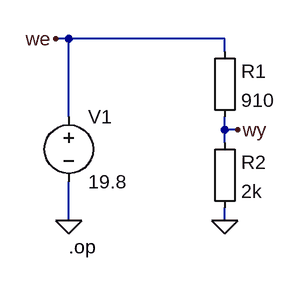
[diagram p0: schematic voltage_divider.asc]
voltage_divider.asc, the LTspice schematic file:
Version 4.1
SHEET 1 880 680
WIRE 64 32 48 32
WIRE 256 32 64 32
WIRE 256 48 256 32
WIRE 64 128 64 32
WIRE 256 144 256 128
WIRE 272 144 256 144
WIRE 256 160 256 144
WIRE 64 256 64 208
WIRE 256 256 256 240
FLAG 64 256 0
FLAG 256 256 0
FLAG 48 32 we
FLAG 272 144 wy
SYMBOL voltage 64 112 R0
WINDOW 123 0 0 Left 0
WINDOW 39 0 0 Left 0
SYMATTR InstName V1
SYMATTR Value 19.8
SYMBOL Misc\\EuropeanResistor 240 32 R0
SYMATTR InstName R1
SYMATTR Value 910
SYMBOL Misc\\EuropeanResistor 240 144 R0
SYMATTR InstName R2
SYMATTR Value 2k
TEXT 64 288 Left 2 !.op

The netlist it stands for:
* voltage_divider.asc
V1 we 0 19.8
R1 we wy 910
R2 wy 0 2k
.op
.backanno
.end